# EasyEDA Pro project ReuseBlock_Cockcrof_Walton_PCB_2025-01-04.epro

# Schematic Cockcrof_Walton_PCB
Board Name: Board1; Create Date: 2025-01-03; Page Name: P1; Project Name: Cockroft_Walton_Adjustable; Schematic Name: Schematic1; Update Date: 2025-01-03; Company: EasyEDA.com; Page Size: A4; Version: V1.0
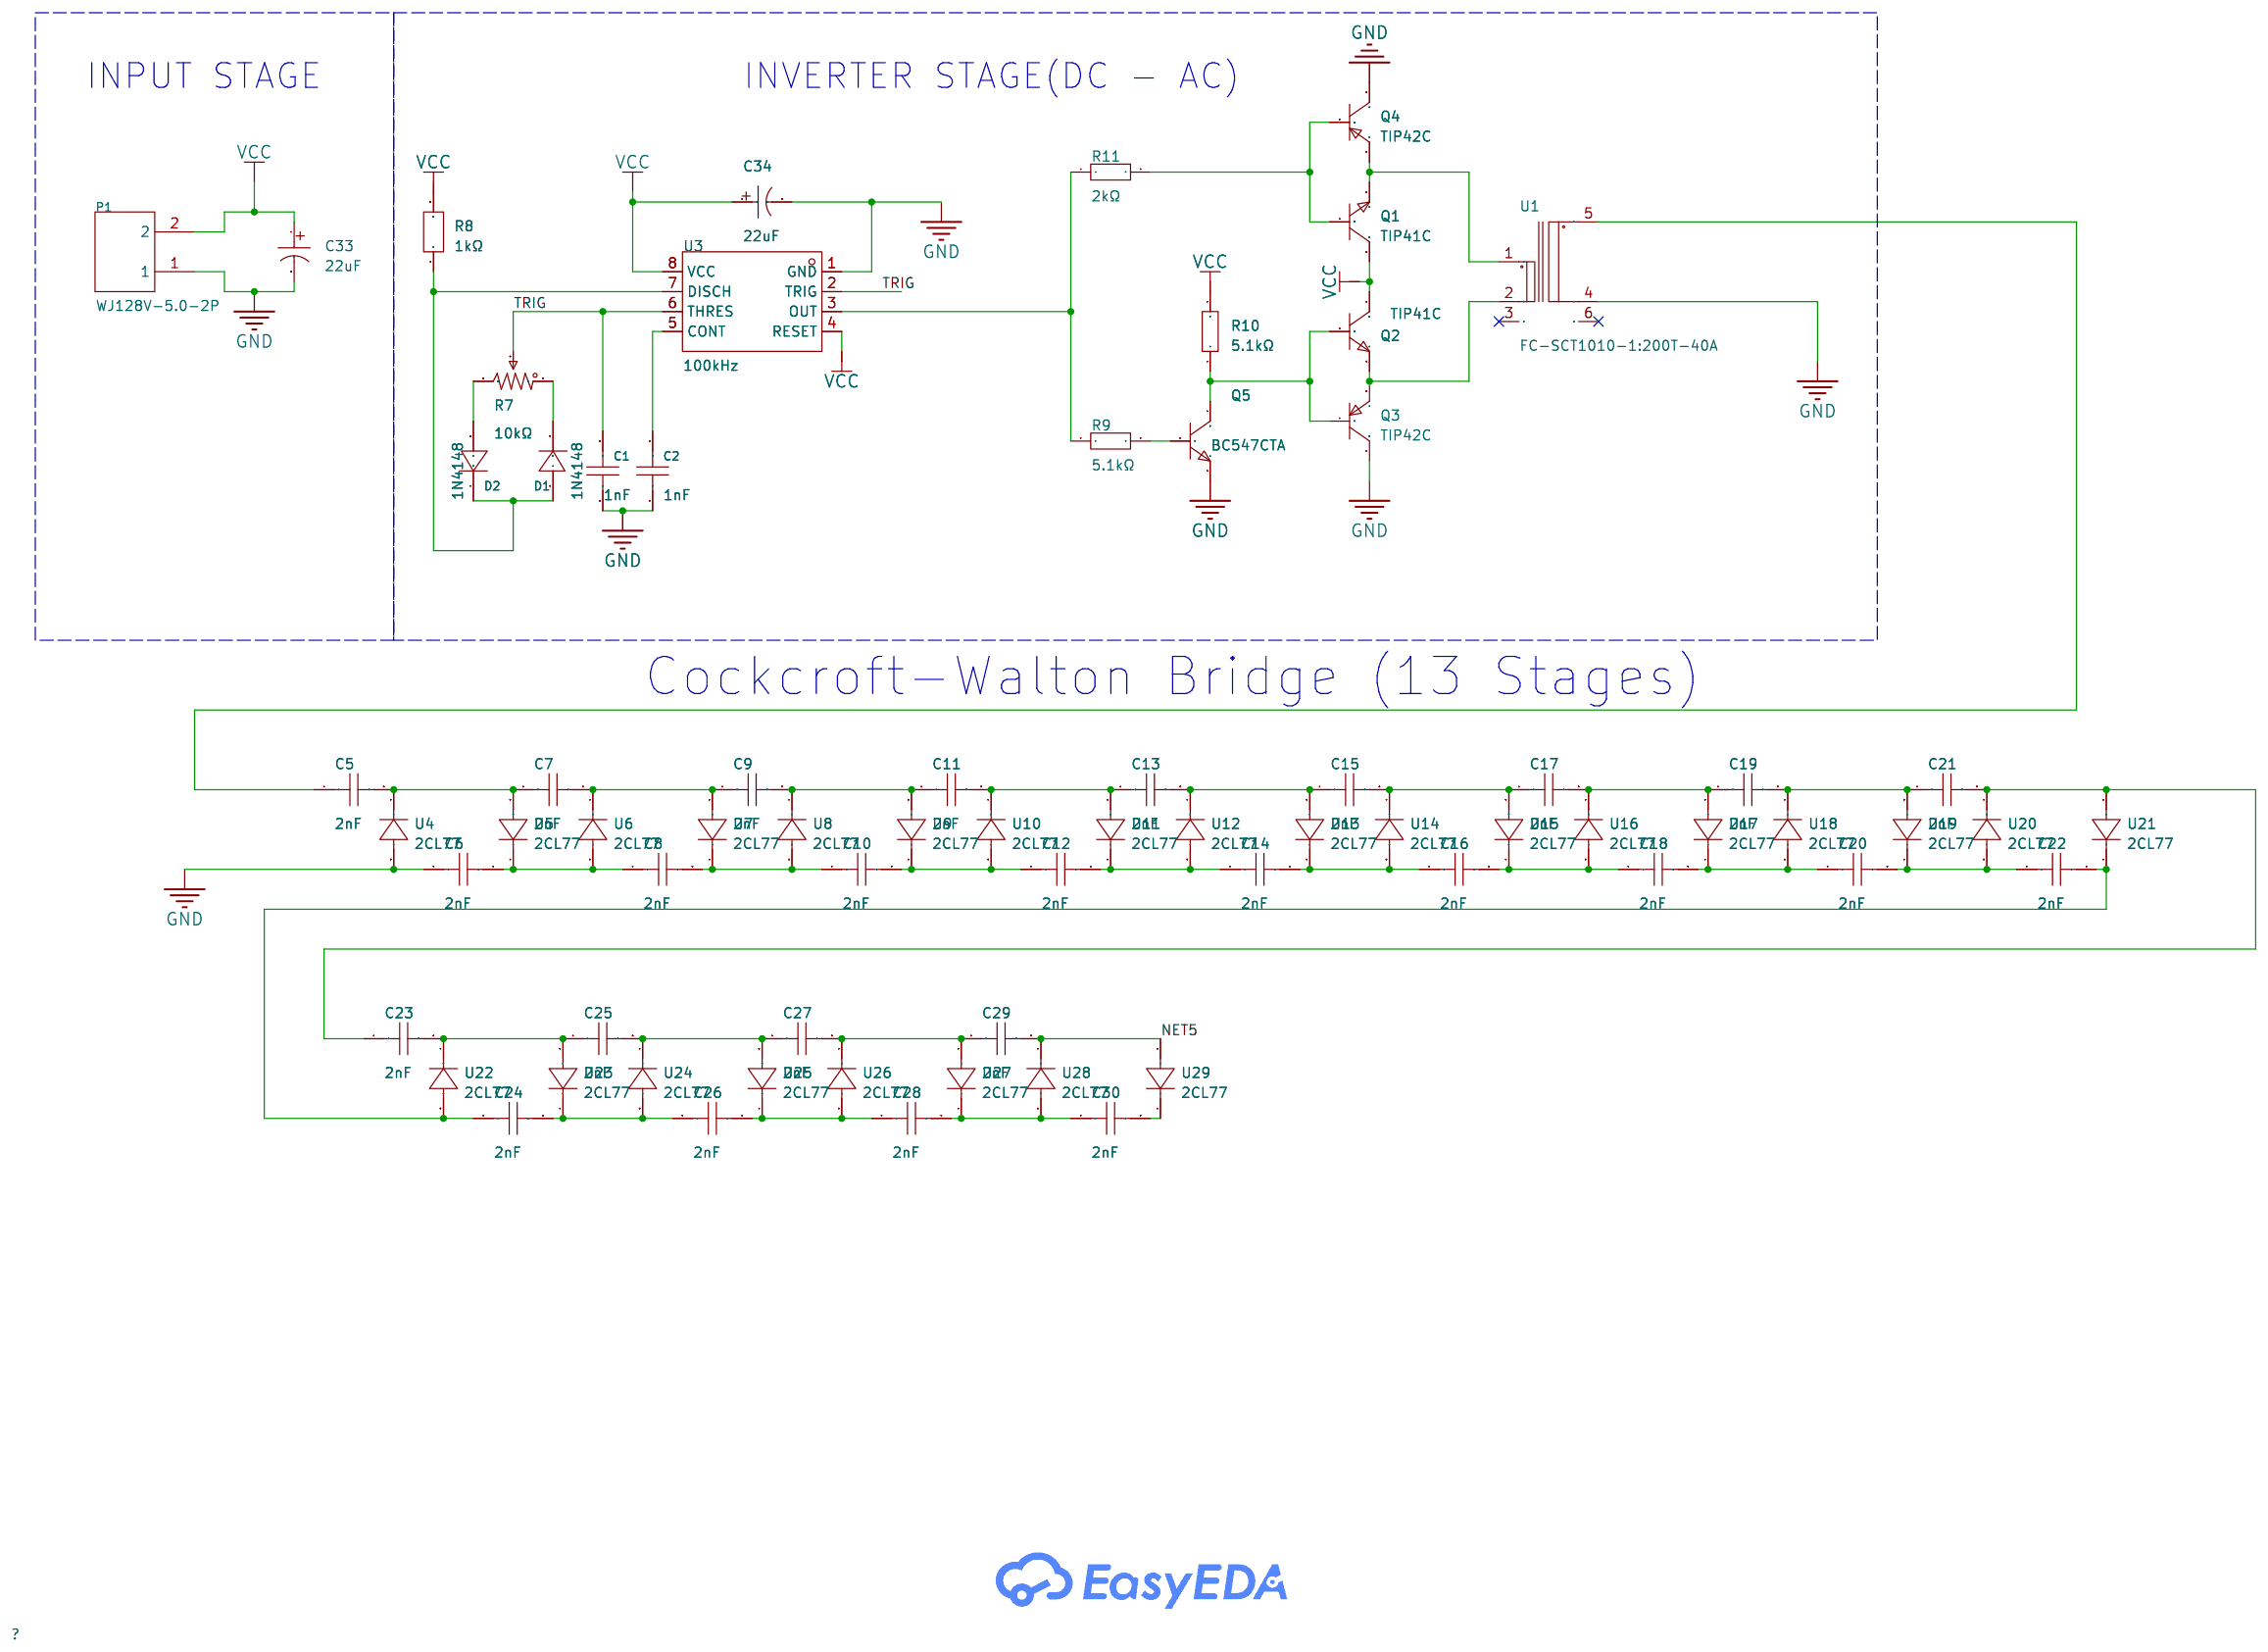
[diagram p0: schematic sheet]

## Parts
C1  1nF  [CAP-TH_L8.0-W3.0-P5.0-D0.60]
C2  1nF  [CAP-TH_L8.0-W3.0-P5.0-D0.60]
C5  2nF  [CAP-TH_L19.0-W8.0-P12.50-D0.8-S8.0]
C6  2nF  [CAP-TH_L19.0-W8.0-P12.50-D0.8-S8.0]
C7  2nF  [CAP-TH_L19.0-W8.0-P12.50-D0.8-S8.0]
C8  2nF  [CAP-TH_L19.0-W8.0-P12.50-D0.8-S8.0]
C9  2nF  [CAP-TH_L19.0-W8.0-P12.50-D0.8-S8.0]
C10  2nF  [CAP-TH_L19.0-W8.0-P12.50-D0.8-S8.0]
C11  2nF  [CAP-TH_L19.0-W8.0-P12.50-D0.8-S8.0]
C12  2nF  [CAP-TH_L19.0-W8.0-P12.50-D0.8-S8.0]
C13  2nF  [CAP-TH_L19.0-W8.0-P12.50-D0.8-S8.0]
C14  2nF  [CAP-TH_L19.0-W8.0-P12.50-D0.8-S8.0]
C15  2nF  [CAP-TH_L19.0-W8.0-P12.50-D0.8-S8.0]
C16  2nF  [CAP-TH_L19.0-W8.0-P12.50-D0.8-S8.0]
C17  2nF  [CAP-TH_L19.0-W8.0-P12.50-D0.8-S8.0]
C18  2nF  [CAP-TH_L19.0-W8.0-P12.50-D0.8-S8.0]
C19  2nF  [CAP-TH_L19.0-W8.0-P12.50-D0.8-S8.0]
C20  2nF  [CAP-TH_L19.0-W8.0-P12.50-D0.8-S8.0]
C21  2nF  [CAP-TH_L19.0-W8.0-P12.50-D0.8-S8.0]
C22  2nF  [CAP-TH_L19.0-W8.0-P12.50-D0.8-S8.0]
C23  2nF  [CAP-TH_L19.0-W8.0-P12.50-D0.8-S8.0]
C24  2nF  [CAP-TH_L19.0-W8.0-P12.50-D0.8-S8.0]
C25  2nF  [CAP-TH_L19.0-W8.0-P12.50-D0.8-S8.0]
C26  2nF  [CAP-TH_L19.0-W8.0-P12.50-D0.8-S8.0]
C27  2nF  [CAP-TH_L19.0-W8.0-P12.50-D0.8-S8.0]
C28  2nF  [CAP-TH_L19.0-W8.0-P12.50-D0.8-S8.0]
C29  2nF  [CAP-TH_L19.0-W8.0-P12.50-D0.8-S8.0]
C30  2nF  [CAP-TH_L19.0-W8.0-P12.50-D0.8-S8.0]
C33  22uF  [CAP-TH_BD5.0-P2.00-D0.8-FD]
C34  22uF  [CAP-TH_BD5.0-P2.00-D0.8-FD]
D1  1N4148  [DO-35_BD2.0-L4.2-P8.20-D0.5-RD]
D2  1N4148  [DO-35_BD2.0-L4.2-P8.20-D0.5-RD]
P1  WJ128V-5.0-2P  [CONN-TH_2P-P5.00_WJ128V-5.0-2P]
Q1  TIP41C  [TO-220-3_L10.0-W4.5-P2.54-T]
Q2  TIP41C  [TO-220-3_L10.0-W4.5-P2.54-T]
Q3  TIP42C  [ITO-220AB-3_L10.2-W4.5-P2.60-L]
Q4  TIP42C  [ITO-220AB-3_L10.2-W4.5-P2.60-L]
Q5  BC547CTA  [TO-92-3_L4.8-W3.7-P2.54-L]
R7  10kΩ  [RES-ADJ-TH_3P-L10.0-W10.0-P2.50-L]
R8  1kΩ  [RES-TH_BD2.3-L6.5-P10.50-D0.5]
R9  5.1kΩ  [RES-TH_BD2.2-L6.5-P10.50-D0.6]
R10  5.1kΩ  [RES-TH_BD2.2-L6.5-P10.50-D0.6]
R11  2kΩ  [RES-TH_BD2.2-L6.5-P10.50-D0.6]
U1  FC-SCT1010-1:200T-40A  [XFMR-SMD_6P-P2.50_FC-SCT1010]
U3  100kHz  [DIP-8_L9.8-W6.6-P2.54-LS7.6-BL]
U4  2CL77  [DIO-TH_BD3.0-L12.0-P16.00-D0.6]
U5  2CL77  [DIO-TH_BD3.0-L12.0-P16.00-D0.6]
U6  2CL77  [DIO-TH_BD3.0-L12.0-P16.00-D0.6]
U7  2CL77  [DIO-TH_BD3.0-L12.0-P16.00-D0.6]
U8  2CL77  [DIO-TH_BD3.0-L12.0-P16.00-D0.6]
U9  2CL77  [DIO-TH_BD3.0-L12.0-P16.00-D0.6]
U10  2CL77  [DIO-TH_BD3.0-L12.0-P16.00-D0.6]
U11  2CL77  [DIO-TH_BD3.0-L12.0-P16.00-D0.6]
U12  2CL77  [DIO-TH_BD3.0-L12.0-P16.00-D0.6]
U13  2CL77  [DIO-TH_BD3.0-L12.0-P16.00-D0.6]
U14  2CL77  [DIO-TH_BD3.0-L12.0-P16.00-D0.6]
U15  2CL77  [DIO-TH_BD3.0-L12.0-P16.00-D0.6]
U16  2CL77  [DIO-TH_BD3.0-L12.0-P16.00-D0.6]
U17  2CL77  [DIO-TH_BD3.0-L12.0-P16.00-D0.6]
U18  2CL77  [DIO-TH_BD3.0-L12.0-P16.00-D0.6]
U19  2CL77  [DIO-TH_BD3.0-L12.0-P16.00-D0.6]
U20  2CL77  [DIO-TH_BD3.0-L12.0-P16.00-D0.6]
U21  2CL77  [DIO-TH_BD3.0-L12.0-P16.00-D0.6]
U22  2CL77  [DIO-TH_BD3.0-L12.0-P16.00-D0.6]
U23  2CL77  [DIO-TH_BD3.0-L12.0-P16.00-D0.6]
U24  2CL77  [DIO-TH_BD3.0-L12.0-P16.00-D0.6]
U25  2CL77  [DIO-TH_BD3.0-L12.0-P16.00-D0.6]
U26  2CL77  [DIO-TH_BD3.0-L12.0-P16.00-D0.6]
U27  2CL77  [DIO-TH_BD3.0-L12.0-P16.00-D0.6]
U28  2CL77  [DIO-TH_BD3.0-L12.0-P16.00-D0.6]
U29  2CL77  [DIO-TH_BD3.0-L12.0-P16.00-D0.6]

## Library data of the parts
C1 C2 = R08B1B102KN0B0S0N0: Capacitance:1nF Tolerance:±10% Tolerance:±10% Voltage Rated: Lead Spacing: Temperature Coefficient: φD: Body Thickness:; LCSC Part Name: 1nF ±10% 2kV; Supplier Part: C249166; Manufacturer: STE(松田); Supplier Footprint: 插件,P=5mm; JLCPCB Part Class: Extended Part; Datasheet: https://atta.szlcsc.com/upload/public/pdf/source/20190806/C366874_7FA13009B587FE73099181E533DD7411.pdf; Supplier: LCSC; Tolerance: ±10%
C5-C30 = HVCC153Y6P202MEAX: Capacitance:2nF Tolerance:±20% Tolerance:±20% Voltage Rated: Lead Spacing: Temperature Coefficient: Diameter:; LCSC Part Name: 2nF ±20% 15kV; Supplier Part: C1623632; Manufacturer: VISHAY(威世); Supplier Footprint: 插件,P=12.5mm; JLCPCB Part Class: Extended Part; Datasheet: https://atta.szlcsc.com/upload/public/pdf/source/20210424/D727BB6E48121EA94A09044E9F6B8D34.pdf; Supplier: LCSC; Tolerance: ±20%
C33 C34 = GR226M050D11RR0VH4FP0: Capacitance:22uF Tolerance:±20% Tolerance:±20% Rated Voltage: Ripple Current:- Equivalent Series Resistance(ESR):- Lead Spacing: φD: L: Lifetime @ Temp:2000hrs@105℃ Operating Temperature:-40℃~+105℃ Operating Temperature:-40℃~+105℃; LCSC Part Name: 22uF ±20% 50V; Supplier Part: C28057; Manufacturer: CX(承兴); Supplier Footprint: 插件,D5xL11mm; JLCPCB Part Class: Extended Part; Datasheet: https://atta.szlcsc.com/upload/public/pdf/source/20211027/ED0DA65C69F42D9BDEC91091BA4C03CD.pdf; Supplier: LCSC; Tolerance: ±20%; Lifetime @ Temp: 2000hrs@105℃; Operating Temperature: -40℃~+105℃
D1 D2 = 1N4148_C402212: Diode Configuration: Forward Voltage (Vf@If):1V@10mA Reverse Voltage (Vr): Average Rectified Current (Io): Power Dissipation: Reverse Leakage Current:5uA@75V Reverse Recovery Time (trr): Operating Temperature:- Operating Temperature:-; LCSC Part Name: 电压:75V 电流:150mA; Supplier Part: C402212; Manufacturer: LGE(鲁光); Supplier Footprint: DO-35; JLCPCB Part Class: Extended Part; Datasheet: https://atta.szlcsc.com/upload/public/pdf/source/20190705/C402212_D6CD0A8EA8714742E0940C7C02C37BFA.pdf; Supplier: LCSC; Forward Voltage (Vf@If): 1V@10mA; Reverse Leakage Current: 5uA@75V
P1 = WJ128V-5.0-2P: Structure:1x2P Pitch:5mm Color:Green Mounting Style:Straight Current Rating (Max):20A Voltage Rating (Max):250V Number of Pins:2P Number of Rows:1 Wire Gauge - AWG:12~22 Wire Gauge - AWG:12~22 Wire Gauge - mm2:2.5 Wire Gauge - mm2:2.5 Number of PINs Per R; LCSC Part Name: 5mm 1x2P 排数:1 每排P数:2 直插; Supplier Part: C8269; Manufacturer: KANGNEX(康奈克斯电气); Supplier Footprint: 插件,P=5mm; JLCPCB Part Class: Extended Part; Datasheet: https://atta.szlcsc.com/upload/public/pdf/source/20191225/C8269_1FF44D6D2E83DB14A7CA266A410FD9AD.pdf; Supplier: LCSC; Structure: 1x2P; Pitch: 5mm; Color: Green; Mounting Style: Straight; Current Rating (Max): 20A; Voltage Rating (Max): 250V; Number of Pins: 2P; Number of Rows: 1; Wire Gauge - AWG: 12~22; Wire Gauge - mm2: 2.5; Number of PINs Per Row: 2; Operating Temperature Range: -40℃~+105℃
Q1 Q2 = TIP41C_C92310: Transistor Type: Collector Current (Ic): Collector-Emitter Breakdown Voltage (Vceo): Power Dissipation (Pd): DC Current Gain (hFE@Ic,Vce):15@3A,4V DC Current Gain (hFE@Ic,Vce):15@3A,4V Transition Frequency (fT):3MHz Collector Cut-Off Current (Icbo):400uA; LCSC Part Name: NPN 电流:6A 耐压:100V; Supplier Part: C92310; Manufacturer: CJ(江苏长电/长晶); Supplier Footprint: TO-220; JLCPCB Part Class: Extended Part; Datasheet: https://atta.szlcsc.com/upload/public/pdf/source/20210427/C92310_50D931BB38CC551CEC4EFCA3D605C981.pdf; Supplier: LCSC; DC Current Gain (hFE@Ic,Vce): 15@3A,4V; Transition Frequency (fT): 3MHz; Collector Cut-Off Current (Icbo): 400uA; Collector-Emitter Saturation Voltage (VCE(sat)@Ic,Ib): 1.5V@6A,0.6A; Operating Temperature: -55℃~+150℃
Q3 Q4 = TIP42C_C410524: Transistor Type: Collector Current (Ic): Collector-Emitter Breakdown Voltage (Vceo): Power Dissipation (Pd): DC Current Gain (hFE@Ic,Vce):15@6A,4V DC Current Gain (hFE@Ic,Vce):15@6A,4V Transition Frequency (fT):- Collector Cut-Off Current (Icbo):0.7mA Col; LCSC Part Name: PNP 电流:6A 耐压:100V; Supplier Part: C410524; Manufacturer: ST(意法半导体); Supplier Footprint: ITO-220AB-3; JLCPCB Part Class: Extended Part; Datasheet: https://atta.szlcsc.com/upload/public/pdf/source/20190807/C410524_597D12F828323BF26BA9F965C9E5EB18.pdf; Supplier: LCSC; DC Current Gain (hFE@Ic,Vce): 15@6A,4V; Collector Cut-Off Current (Icbo): 0.7mA; Collector-Emitter Saturation Voltage (VCE(sat)@Ic,Ib): 1.5V@6A,0.6A; Operating Temperature: -65℃~+150℃
Q5 = BC547CTA: Transistor Type: Collector Current (Ic): Collector-Emitter Breakdown Voltage (Vceo): Power Dissipation (Pd): DC Current Gain (hFE@Ic,Vce):110@2mA,5V DC Current Gain (hFE@Ic,Vce):110@2mA,5V Transition Frequency (fT):300MHz Collector Cut-Off Current (Icbo):; LCSC Part Name: NPN 电流:100mA 耐压:45V; Supplier Part: C900799; Manufacturer: onsemi(安森美); Supplier Footprint: TO-92-3; JLCPCB Part Class: Extended Part; Datasheet: https://atta.szlcsc.com/upload/public/pdf/source/20210714/C900799_40BEF7C12D9842BCC6F655C2B13CF149.pdf; Supplier: LCSC; DC Current Gain (hFE@Ic,Vce): 110@2mA,5V; Transition Frequency (fT): 300MHz; Collector Cut-Off Current (Icbo): 15nA; Collector-Emitter Saturation Voltage (VCE(sat)@Ic,Ib): 250mV@100mA,5mA; Operating Temperature: -65℃~+150℃
R7 = 3296W-1-103_C118954: Resistance: Tolerance:±10% Tolerance:±10%; LCSC Part Name: 10kΩ ±10%; Supplier Part: C118954; Manufacturer: BOCHEN(博晨); Manufacturer Part: 3296W-1-103; Supplier Footprint: 插件; JLCPCB Part Class: Extended Part; Datasheet: https://atta.szlcsc.com/upload/public/pdf/source/20171114/C118954_15106326646611117443.pdf; Supplier: LCSC; Tolerance: ±10%
R8 = MF1/4W-1KΩ±1%T52: Type:Metal Film Resistors Resistance: Tolerance:±1% Tolerance:±1% Power(Watts):250mW Temperature Coefficient:±200ppm/℃ Temperature Coefficient:±200ppm/℃; LCSC Part Name: 金属膜电阻 1kΩ ±1% 250mW; Supplier Part: C713997; Manufacturer: 华星机电; Supplier Footprint: 插件,D2.3xL6.5mm; JLCPCB Part Class: Extended Part; Datasheet: https://atta.szlcsc.com/upload/public/pdf/source/20200731/C713882_AE8EB1102749D7E4FB4FB13DC898C429.pdf; Supplier: LCSC; Type: Metal Film Resistors; Tolerance: ±1%; Power(Watts): 250mW; Temperature Coefficient: ±200ppm/℃
R9 R10 = CFR0W4J0512A50: Type:Carbon Resister Resistance:5.1kΩ Tolerance:±5% Tolerance:±5% Overload Voltage (Max):250V Power(Watts):250mW Temperature Coefficient:±450ppm/℃ Temperature Coefficient:±450ppm/℃; LCSC Part Name: 5.1kΩ ±5% 250mW 碳膜电阻; Supplier Part: C61298; Manufacturer: UNI-ROYAL(厚声); Supplier Footprint: 插件,D2.2xL6.5mm; JLCPCB Part Class: Extended Part; Datasheet: https://atta.szlcsc.com/upload/public/pdf/source/20180620/C62413_7E5B8E64E44DC6B6C3C4C06CC31E092F.pdf; Supplier: LCSC; Type: Carbon Resister; Tolerance: ±5%; Overload Voltage (Max): 250V; Power(Watts): 250mW; Temperature Coefficient: ±450ppm/℃
R11 = MFR0W4F2001A50: Type:Metal Film Resistors Resistance:2kΩ Tolerance:±1% Tolerance:±1% Overload Voltage (Max):250V Power(Watts):250mW Temperature Coefficient:±50ppm/℃ Temperature Coefficient:±50ppm/℃; LCSC Part Name: 2kΩ ±1% 250mW 金属膜电阻; Supplier Part: C58593; Manufacturer: UNI-ROYAL(厚声); Supplier Footprint: 插件,D2.2xL6.5mm; JLCPCB Part Class: Extended Part; Datasheet: https://atta.szlcsc.com/upload/public/pdf/source/20191012/C436293_8820AA14BC71FA35E551C06C441482A0.pdf; Supplier: LCSC; Type: Metal Film Resistors; Tolerance: ±1%; Overload Voltage (Max): 250V; Power(Watts): 250mW; Temperature Coefficient: ±50ppm/℃
U1 = FC-SCT1010-1:200T-40A: Current Ratio:1:200 Current Rating:40A; Supplier Part: C18186221; Manufacturer: FC(方成); Supplier Footprint: SMD; JLCPCB Part Class: Extended Part; Datasheet: https://atta.szlcsc.com/upload/public/pdf/source/20230906/E94D5CAEECBE152A080A55270BEAC160.pdf; Supplier: LCSC; Current Ratio: 1:200; Current Rating: 40A
U3 = NE555P: Frequency:100kHz Supply Voltage:4.5V~16V Supply Voltage:4.5V~16V Supply Current:10mA Operating Temperature:0℃~+70℃ Operating Temperature:0℃~+70℃; Supplier Part: C46749; Manufacturer: TI(德州仪器); Supplier Footprint: DIP-8; JLCPCB Part Class: Extended Part; Datasheet: https://www.ti.com/cn/lit/gpn/ne555; Supplier: LCSC; Supply Voltage: 4.5V~16V; Supply Current: 10mA; Operating Temperature: 0℃~+70℃
U4-U29 = 2CL77: Reverse Voltage (Vr): Average Rectified Current (Io): Reverse Leakage Current:2uA; LCSC Part Name: 电压:20kV 电流:5mA; Supplier Part: C424513; Manufacturer: SUNMATE(森美特); Supplier Footprint: 插件,D3xL12mm; JLCPCB Part Class: Extended Part; Datasheet: https://atta.szlcsc.com/upload/public/pdf/source/20220617/7024E2F52CE4C6745875D4ADB64BCCE6.pdf; Supplier: LCSC; Reverse Leakage Current: 2uA

## Nets
GND: C1.1 C2.1 C6.1 C33.2 C34.2 P1.1 Q3.2(C) Q4.2(C) Q5.3(E) U1.4 U3.1(GND) U4.2(A)
VCC: C33.1 C34.1 P1.2 Q1.2(C) Q2.2(C) R8.2 R10.2 U3.4(RESET) U3.8(VCC)
NET5: C29.2 U28.1(K) U29.2(A)
TRIG: C1.2 R7.2 U3.2(TRIG) U3.6(THRES)
$1N872: Q2.3(E) Q3.3(E) U1.2
$1N998: Q1.3(E) Q4.3(E) U1.1
$1N1038: Q2.1(B) Q3.1(B) Q5.1(C) R10.1
$1N1044: Q1.1(B) Q4.1(B) R11.2
$1N1125: Q5.2(B) R9.2
$1N1129: R9.1 R11.1 U3.3(OUT)
$1N1691: D2.2(A) R7.3
$1N1693: D1.1(C) R7.1
$1N1749: C2.2 U3.5(CONT)
$1N1755: D1.2(A) D2.1(C) R8.1 U3.7(DISCH)
$1N2141: C5.2 C7.1 U4.1(K) U5.2(A)
$1N2190: C6.2 C8.1 U5.1(K) U6.2(A)
$1N2475: C7.2 C9.1 U6.1(K) U7.2(A)
$1N2479: C8.2 C10.1 U7.1(K) U8.2(A)
$1N2619: C9.2 C11.1 U8.1(K) U9.2(A)
$1N2623: C10.2 C12.1 U9.1(K) U10.2(A)
$1N2763: C11.2 C13.1 U10.1(K) U11.2(A)
$1N2767: C12.2 C14.1 U11.1(K) U12.2(A)
$1N2907: C13.2 C15.1 U12.1(K) U13.2(A)
$1N2911: C14.2 C16.1 U13.1(K) U14.2(A)
$1N3051: C15.2 C17.1 U14.1(K) U15.2(A)
$1N3055: C16.2 C18.1 U15.1(K) U16.2(A)
$1N3195: C17.2 C19.1 U16.1(K) U17.2(A)
$1N3199: C18.2 C20.1 U17.1(K) U18.2(A)
$1N3339: C19.2 C21.1 U18.1(K) U19.2(A)
$1N3343: C20.2 C22.1 U19.1(K) U20.2(A)
$1N3631: C24.2 C26.1 U23.1(K) U24.2(A)
$1N3775: C26.2 C28.1 U25.1(K) U26.2(A)
$1N3919: C28.2 C30.1 U27.1(K) U28.2(A)
$1N4063: C30.2 U29.1(K)
$1N4211: C25.2 C27.1 U24.1(K) U25.2(A)
$1N4214: C27.2 C29.1 U26.1(K) U27.2(A)
$1N4243: C22.2 C24.1 U21.1(K) U22.2(A)
$1N4268: C21.2 C23.1 U20.1(K) U21.2(A)
$1N4271: C23.2 C25.1 U22.1(K) U23.2(A)
$1N4334: C5.1 U1.5

Not connected (* = marked no-connect by the designer): U1 3* 6*

## Notes on the sheet
- INPUT STAGE
- INVERTER STAGE(DC - AC)
- Cockcroft-Walton Bridge (13 Stages)

# Board Cockcrof_Walton_PCB
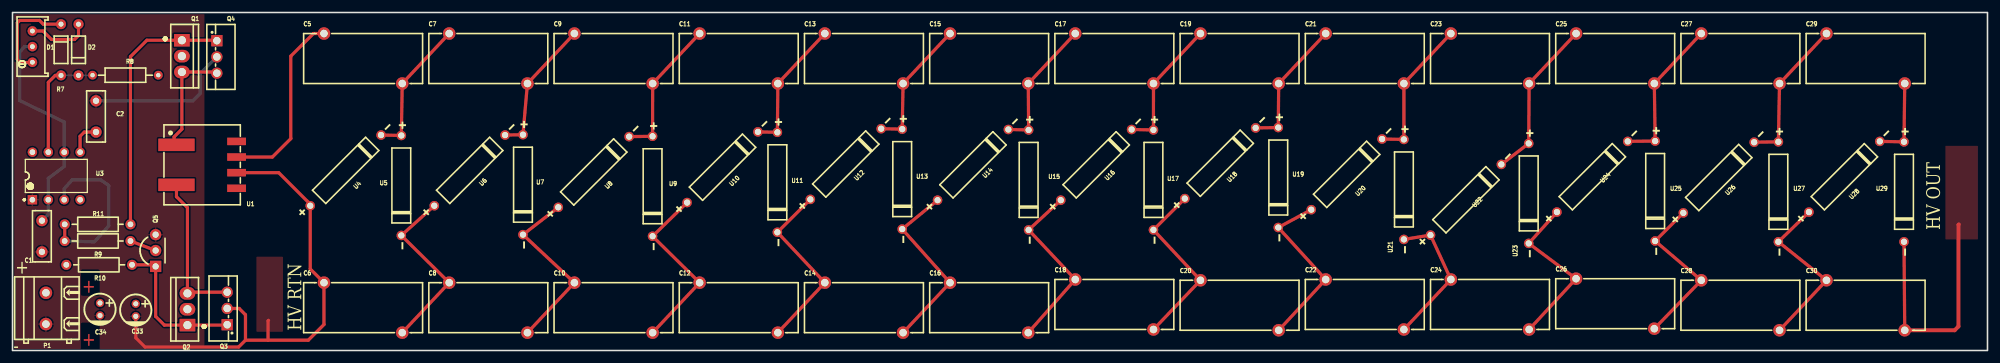
[diagram p1: board, top side]
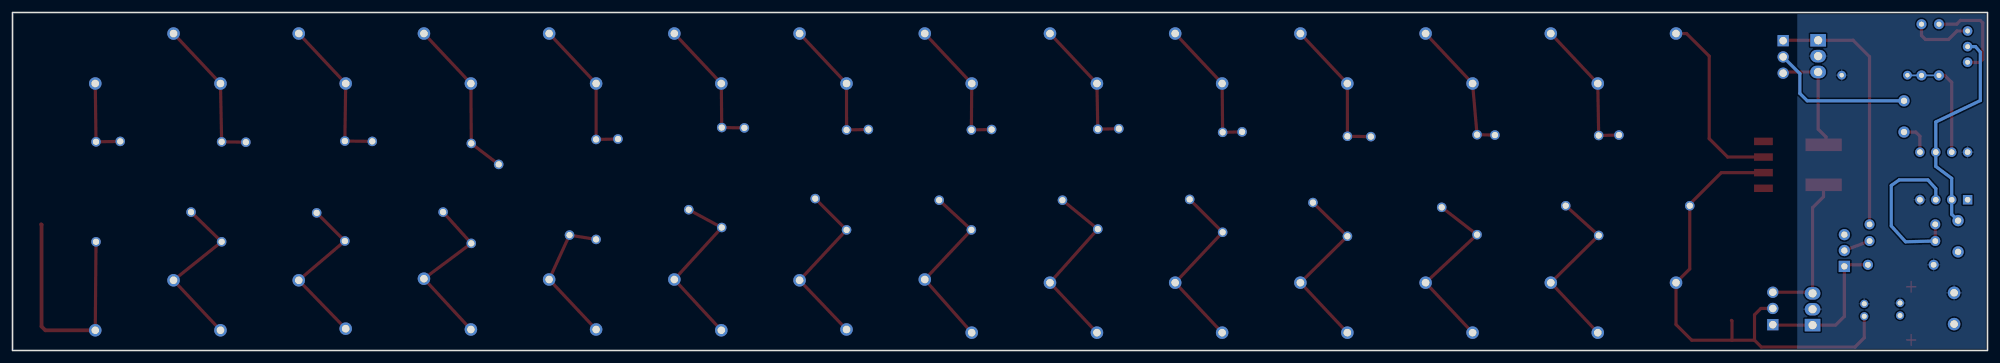
[diagram p2: board, bottom side, seen from below]

Outline 315.47 x 54.1 mm; copper layers: Top Layer, Bottom Layer. Coordinates in mm from the lower left corner of the outline.
Outline path: rectangle 0,54.1 315.47,0
Stack: Top Layer 0.035mm / Dielectric1 1.51mm FR4 er 4.5 / Bottom Layer 0.035mm

## Design rules (mm)
template: JLCPCB Capability(Two Layers Board)
spacing copperThickness1oz (default): track to track 0.102, other pairs 0.152 to 0.3
spacing copperThickness2oz: track to track 0.203, other pairs 0.152 to 0.3
track width copperThickness1oz (default): min 0.127, default 0.254, max 2.54
track width copperThickness2oz: min 0.203, default 0.254, max 2.54
differential pair differentialPair (default): width min 0.127, default 0.254, max 2.54; gap min 0.152, default 0.152
via viaSize (default): diameter min 0.5, default 0.61, max 10; hole min 0.3, default 0.305, max 6.3

## Placement (name value [footprint] x y rotation side)
C1  1nF  [CAP-TH_L8.0-W3.0-P5.0-D0.60]  4.7 18.29 90 top
C2  1nF  [CAP-TH_L8.0-W3.0-P5.0-D0.60]  13.34 37.47 270 top
C5  2nF  [CAP-TH_L19.0-W8.0-P12.50-D0.8-S8.0]  56 46.74 0 top
C6  2nF  [CAP-TH_L19.0-W8.0-P12.50-D0.8-S8.0]  56 6.86 0 top
C7  2nF  [CAP-TH_L19.0-W8.0-P12.50-D0.8-S8.0]  76 46.74 0 top
C8  2nF  [CAP-TH_L19.0-W8.0-P12.50-D0.8-S8.0]  76 6.86 0 top
C9  2nF  [CAP-TH_L19.0-W8.0-P12.50-D0.8-S8.0]  96 46.74 0 top
C10  2nF  [CAP-TH_L19.0-W8.0-P12.50-D0.8-S8.0]  96 6.86 0 top
C11  2nF  [CAP-TH_L19.0-W8.0-P12.50-D0.8-S8.0]  116 46.74 0 top
C12  2nF  [CAP-TH_L19.0-W8.0-P12.50-D0.8-S8.0]  116 6.86 0 top
C13  2nF  [CAP-TH_L19.0-W8.0-P12.50-D0.8-S8.0]  136 46.74 0 top
C14  2nF  [CAP-TH_L19.0-W8.0-P12.50-D0.8-S8.0]  136 6.86 0 top
C15  2nF  [CAP-TH_L19.0-W8.0-P12.50-D0.8-S8.0]  156 46.74 0 top
C16  2nF  [CAP-TH_L19.0-W8.0-P12.50-D0.8-S8.0]  156 6.86 0 top
C17  2nF  [CAP-TH_L19.0-W8.0-P12.50-D0.8-S8.0]  176 46.74 0 top
C18  2nF  [CAP-TH_L19.0-W8.0-P12.50-D0.8-S8.0]  176 7.37 0 top
C19  2nF  [CAP-TH_L19.0-W8.0-P12.50-D0.8-S8.0]  196 46.74 0 top
C20  2nF  [CAP-TH_L19.0-W8.0-P12.50-D0.8-S8.0]  196 7.24 0 top
C21  2nF  [CAP-TH_L19.0-W8.0-P12.50-D0.8-S8.0]  216 46.74 0 top
C22  2nF  [CAP-TH_L19.0-W8.0-P12.50-D0.8-S8.0]  216 7.37 0 top
C23  2nF  [CAP-TH_L19.0-W8.0-P12.50-D0.8-S8.0]  236 46.74 0 top
C24  2nF  [CAP-TH_L19.0-W8.0-P12.50-D0.8-S8.0]  236 7.37 0 top
C25  2nF  [CAP-TH_L19.0-W8.0-P12.50-D0.8-S8.0]  256 46.74 0 top
C26  2nF  [CAP-TH_L19.0-W8.0-P12.50-D0.8-S8.0]  256 7.49 0 top
C27  2nF  [CAP-TH_L19.0-W8.0-P12.50-D0.8-S8.0]  276 46.74 0 top
C28  2nF  [CAP-TH_L19.0-W8.0-P12.50-D0.8-S8.0]  276 7.24 0 top
C29  2nF  [CAP-TH_L19.0-W8.0-P12.50-D0.8-S8.0]  296 46.74 0 top
C30  2nF  [CAP-TH_L19.0-W8.0-P12.50-D0.8-S8.0]  296 7.24 0 top
C33  22uF  [CAP-TH_BD5.0-P2.00-D0.8-FD]  19.69 6.48 270 top
C34  22uF  [CAP-TH_BD5.0-P2.00-D0.8-FD]  13.97 6.6 270 top
D1  1N4148  [DO-35_BD2.0-L4.2-P8.20-D0.5-RD]  7.75 48.13 270 top
D2  1N4148  [DO-35_BD2.0-L4.2-P8.20-D0.5-RD]  10.54 48.13 90 top
P1  WJ128V-5.0-2P  [CONN-TH_2P-P5.00_WJ128V-5.0-2P]  5.33 6.73 90 top
Q1  TIP41C  [TO-220-3_L10.0-W4.5-P2.54-T]  27.05 47.12 0 top
Q2  TIP41C  [TO-220-3_L10.0-W4.5-P2.54-T]  27.94 6.6 180 top
Q3  TIP42C  [ITO-220AB-3_L10.2-W4.5-P2.60-L]  34.29 6.73 90 top
Q4  TIP42C  [ITO-220AB-3_L10.2-W4.5-P2.60-L]  32.64 46.99 270 top
Q5  BC547CTA  [TO-92-3_L4.8-W3.7-P2.54-L]  22.86 16 90 top
R7  10kΩ  [RES-ADJ-TH_3P-L10.0-W10.0-P2.50-L]  3.17 48.64 90 top
R8  1kΩ  [RES-TH_BD2.3-L6.5-P10.50-D0.5]  18.03 44.07 0 top
R9  5.1kΩ  [RES-TH_BD2.2-L6.5-P10.50-D0.6]  13.59 17.53 0 top
R10  5.1kΩ  [RES-TH_BD2.2-L6.5-P10.50-D0.6]  13.84 13.72 180 top
R11  2kΩ  [RES-TH_BD2.2-L6.5-P10.50-D0.6]  13.59 20.19 0 top
U1  FC-SCT1010-1:200T-40A  [XFMR-SMD_6P-P2.50_FC-SCT1010]  30.99 29.72 180 top
U3  100kHz  [DIP-8_L9.8-W6.6-P2.54-LS7.6-BL]  6.98 27.94 0 top
U4  2CL77  [DIO-TH_BD3.0-L12.0-P16.00-D0.6]  53.21 28.83 225 top
U5  2CL77  [DIO-TH_BD3.0-L12.0-P16.00-D0.6]  62.1 26.42 90 top
U6  2CL77  [DIO-TH_BD3.0-L12.0-P16.00-D0.6]  73.03 28.83 225 top
U7  2CL77  [DIO-TH_BD3.0-L12.0-P16.00-D0.6]  81.53 26.54 90 top
U8  2CL77  [DIO-TH_BD3.0-L12.0-P16.00-D0.6]  92.84 28.58 225 top
U9  2CL77  [DIO-TH_BD3.0-L12.0-P16.00-D0.6]  102.23 26.29 90 top
U10  2CL77  [DIO-TH_BD3.0-L12.0-P16.00-D0.6]  113.41 29.34 225 top
U11  2CL77  [DIO-TH_BD3.0-L12.0-P16.00-D0.6]  122.17 26.92 90 top
U12  2CL77  [DIO-TH_BD3.0-L12.0-P16.00-D0.6]  133.1 29.84 225 top
U13  2CL77  [DIO-TH_BD3.0-L12.0-P16.00-D0.6]  142.11 27.43 90 top
U14  2CL77  [DIO-TH_BD3.0-L12.0-P16.00-D0.6]  153.42 29.72 225 top
U15  2CL77  [DIO-TH_BD3.0-L12.0-P16.00-D0.6]  162.31 27.31 90 top
U16  2CL77  [DIO-TH_BD3.0-L12.0-P16.00-D0.6]  173.1 29.72 225 top
U17  2CL77  [DIO-TH_BD3.0-L12.0-P16.00-D0.6]  182.25 27.31 90 top
U18  2CL77  [DIO-TH_BD3.0-L12.0-P16.00-D0.6]  192.91 29.97 225 top
U19  2CL77  [DIO-TH_BD3.0-L12.0-P16.00-D0.6]  202.18 27.69 90 top
U20  2CL77  [DIO-TH_BD3.0-L12.0-P16.00-D0.6]  213.11 28.19 225 top
U21  2CL77  [DIO-TH_BD3.0-L12.0-P16.00-D0.6]  222.25 25.78 90 top
U22  2CL77  [DIO-TH_BD3.0-L12.0-P16.00-D0.6]  232.16 24.13 225 top
U23  2CL77  [DIO-TH_BD3.0-L12.0-P16.00-D0.6]  242.19 25.15 90 top
U24  2CL77  [DIO-TH_BD3.0-L12.0-P16.00-D0.6]  252.35 27.81 225 top
U25  2CL77  [DIO-TH_BD3.0-L12.0-P16.00-D0.6]  262.38 25.53 90 top
U26  2CL77  [DIO-TH_BD3.0-L12.0-P16.00-D0.6]  272.54 27.69 225 top
U27  2CL77  [DIO-TH_BD3.0-L12.0-P16.00-D0.6]  282.07 25.4 90 top
U28  2CL77  [DIO-TH_BD3.0-L12.0-P16.00-D0.6]  292.61 27.81 225 top
U29  2CL77  [DIO-TH_BD3.0-L12.0-P16.00-D0.6]  302.13 25.4 90 top

## Footprints (pads in the part's own frame, mm; a bottom-side part is the same pattern mirrored in y, then rotated)
CAP-TH_BD5.0-P2.00-D0.8-FD
  round 1.3 hole 0.8: 1(-1,0) 2(1,0)
CAP-TH_L8.0-W3.0-P5.0-D0.60
  round 1.8 hole 1: 1(-2.5,0) 2(2.5,0)
CAP-TH_L19.0-W8.0-P12.50-D0.8-S8.0
  round 2 hole 1.2: 1(-6.25,4) 2(6.25,-4)
CONN-TH_2P-P5.00_WJ128V-5.0-2P
  round 2 hole 1.2: 1(-2.505,0) 2(2.505,0)
DIO-TH_BD3.0-L12.0-P16.00-D0.6
  round 1.524 hole 1: 1(-8,0) 2(8,0)
DIP-8_L9.8-W6.6-P2.54-LS7.6-BL
  rect 1.5x1.5 hole 0.9: 1(-3.81,-3.81)
  round 1.5 hole 0.9: 2(-1.27,-3.81) 3(1.27,-3.81) 4(3.81,-3.81) 5(3.81,3.81) 6(1.27,3.81) 7(-1.27,3.81) 8(-3.81,3.81)
DO-35_BD2.0-L4.2-P8.20-D0.5-RD
  round 1.6 hole 0.8: 1(-4.1,0) 2(4.1,0)
ITO-220AB-3_L10.2-W4.5-P2.60-L
  rect 1.8x1.8 hole 1.2: 1(-2.6,0)
  round 1.8 hole 1.2: 2(0,0) 3(2.6,0)
RES-ADJ-TH_3P-L10.0-W10.0-P2.50-L
  round 1.524 hole 0.762: 1(-2.5,0) 2(0,0) 3(2.5,0)
RES-TH_BD2.2-L6.5-P10.50-D0.6
  round 1.6 hole 0.914: 1(-5.25,0) 2(5.25,0)
RES-TH_BD2.3-L6.5-P10.50-D0.5
  round 1.4 hole 0.7: 1(-5.25,0) 2(5.25,0)
TO-92-3_L4.8-W3.7-P2.54-L
  rect 1.8x1.8 hole 1: 1(-2.54,0)
  round 1.8 hole 1: 2(0,0) 3(2.54,0)
TO-220-3_L10.0-W4.5-P2.54-T
  rect 2.5x2 hole 1.3: 1(0,2.54)
  oval 2.5x2 hole 1.3: 2(0,0) 3(0,-2.54)
XFMR-SMD_6P-P2.50_FC-SCT1010
  rect 5.8x2 smd: 1(4.8,-3.2) 2(4.8,3.2)
  rect 3x1.2 smd: 3(-4.8,3.75) 4(-4.8,1.25) 5(-4.8,-1.25) 6(-4.8,-3.75)

## Nets
As in the schematic.

Pads without a net: U1 3 6

## Routing (per net, layer and track width the routed paths; a pad name or vN(x,y) marks a point on that pad's centre or on a via; arc(x,y) is an arc through that point)
GND: length 104.3
  Top Layer w0.508: 40.82,1.65 40.82,4.75 40.89,4.83 ; 40.82,1.65 47.24,1.65 49.75,4.16 C6.1 47.56,13.05 U4.2 47.56,23.43 42.51,28.47 U1.4 ; 40.82,1.65 37.21,1.65 ; 37.21,1.65 37.21,5.72 36.2,6.73 Q3.2 ; 37.21,1.65 36.11,0.55 21.16,0.55 19.69,2.03 C33.2
  Bottom Layer w0.508: C2.1 28.79,39.97 29.97,41.15 29.97,44.32 Q4.2
NET5: length 13.2
  Top Layer w0.508: C29.2 U29.2 U28.1
TRIG: length 35.6
  Bottom Layer w0.508: R7.2 1.9,48.64 1.14,47.75 1.14,40.01 8.25,36.58 U3.6 8.25,29.46 5.71,27.56 U3.2 5.71,21.8 C1.2
$1N872: length 24.5
  Top Layer w0.508: U1.2 26.19,24.61 27.94,22.86 Q2.3 28.13,9.33 Q3.3
$1N998: length 18
  Top Layer w0.508: U1.1 25.81,33.3 25.81,34.19 27.05,35.43 Q1.3 32.45,44.58 Q4.3
$1N1038: length 23.9
  Top Layer w0.508: R10.1 22.61,13.72 Q5.1 22.86,5.46 24.26,4.06 Q2.1 34.22,4.06 Q3.1
$1N1044: length 41.8
  Top Layer w0.508: R11.2 18.84,47.03 21.46,49.66 Q1.1 32.57,49.66 Q4.1
$1N1125: length 4.3
  Top Layer w0.508: Q5.2 R9.2
$1N1129: length 27.1
  Top Layer w0.508: R9.1 R11.1
  Bottom Layer w0.508: R9.1 13.08,17.4 15.37,19.94 15.37,26.42 14.1,27.31 9.53,27.31 8.25,25.91 U3.3
$1N1691: length 10
  Top Layer w0.508: R7.3 4.87,51.14 6.22,49.78 9.91,49.78 10.54,50.42 10.54,52.23
$1N1693: length 15.9
  Top Layer w0.508: R7.1 3.13,46.1 1.27,46.1 0.76,46.61 0.76,52.45 1.14,52.83 4.32,52.83 4.92,52.23 7.75,52.23
$1N1749: length 5.4
  Top Layer w0.508: C2.2 11.47,34.97 10.79,34.29 10.79,31.75
$1N1755: length 18.7
  Top Layer w0.508: U3.7 5.71,42.93 6.82,44.03 D1.2
  Bottom Layer w0.254: R8.1 12.75,44.03 D2.1 D1.2
$1N2141: length 22.5
  Top Layer w0.508: C7.1 C5.2 U5.2 U4.1
$1N2190: length 28.8
  Top Layer w0.508: C6.2 C8.1 U5.1 U6.2
$1N2475: length 22
  Top Layer w0.508: C9.1 C7.2 U7.2 U6.1
$1N2479: length 29.4
  Top Layer w0.508: U8.2 U7.1 C10.1 C8.2
$1N2619: length 23.2
  Top Layer w0.508: U8.1 U9.2 C9.2 C11.1
$1N2623: length 29.3
  Top Layer w0.508: U10.2 U9.1 C12.1 C10.2
$1N2763: length 21.9
  Top Layer w0.508: C13.1 C11.2 U11.2 U10.1
$1N2767: length 29.5
  Top Layer w0.508: U12.2 U11.1 C14.1 C12.2
$1N2907: length 21.6
  Top Layer w0.508: U12.1 U13.2 C13.2 C15.1
$1N2911: length 29.8
  Top Layer w0.508: U14.2 U13.1 C16.1 C14.2
$1N3051: length 21.6
  Top Layer w0.508: U14.1 U15.2 C15.2 C17.1
$1N3055: length 29.2
  Top Layer w0.508: C16.2 C18.1 U15.1 U16.2
$1N3195: length 21.9
  Top Layer w0.508: U16.1 U17.2 C17.2 C19.1
$1N3199: length 29
  Top Layer w0.508: C18.2 C20.1 U17.1 187.26,24.31
$1N3339: length 21.6
  Top Layer w0.508: 198.57,35.63 U19.2 C19.2 C21.1
$1N3343: length 28.3
  Top Layer w0.508: 207.45,22.54 U19.1 C22.1 C20.2
$1N3631: length 27.2
  Top Layer w0.508: C24.2 C26.1 U23.1 U24.2
$1N3775: length 26.8
  Top Layer w0.508: 262.25,3.49 C28.1 U25.1 266.88,22.03
$1N3919: length 27.6
  Top Layer w0.508: U28.2 U27.1 C30.1 C28.2
$1N4063: length 39.4
  Top Layer w0.508: C30.2 U29.1
  Top Layer w0.61: 310.9,20.19 310.83,20.13 310.83,3.85 310.22,3.24 C30.2
$1N4211: length 24.6
  Top Layer w0.508: U24.1 U25.2 C25.2 C27.1
$1N4214: length 24.2
  Top Layer w0.508: C29.1 C27.2 U27.2 278.2,33.34
$1N4243: length 23.1
  Top Layer w0.508: U21.1 U22.2 C24.1 C22.2
$1N4268: length 23.4
  Top Layer w0.508: C23.1 C21.2 U21.2 218.76,33.85
$1N4271: length 26.1
  Top Layer w0.508: U22.1 U23.2 C23.2 C25.1
$1N4334: length 29.9
  Top Layer w0.508: C5.1 48.07,50.74 44.45,47.12 44.45,33.91 41.51,30.97 U1.5

## Copper pours and planes (outline as drawn; the poured copper is in the pictures)
GND on Top Layer: 38.99,14.99 43.18,14.99 43.18,3.05 38.99,3.05
GND on Top Layer: 38.99,14.99 43.18,14.99 43.18,3.05 38.99,3.05
GND on Top Layer: 0,54.1 30.65,54.1 30.65,0 0,0
VCC on Bottom Layer: -0.25,54.1 30.39,54.1 30.39,0 -0.25,0
$1N4063 on Top Layer: 308.74,32.77 313.94,32.77 313.94,17.78 308.74,17.78

Small or netless copper shapes (teardrops, artwork), in the pictures only: 1 on Top Layer

## Text on the board
Top Layer: +
Top Silkscreen Layer: - | + | HV RTN | HV OUT
